# EAGLE design mainbd (EAGLE 9.6.2)
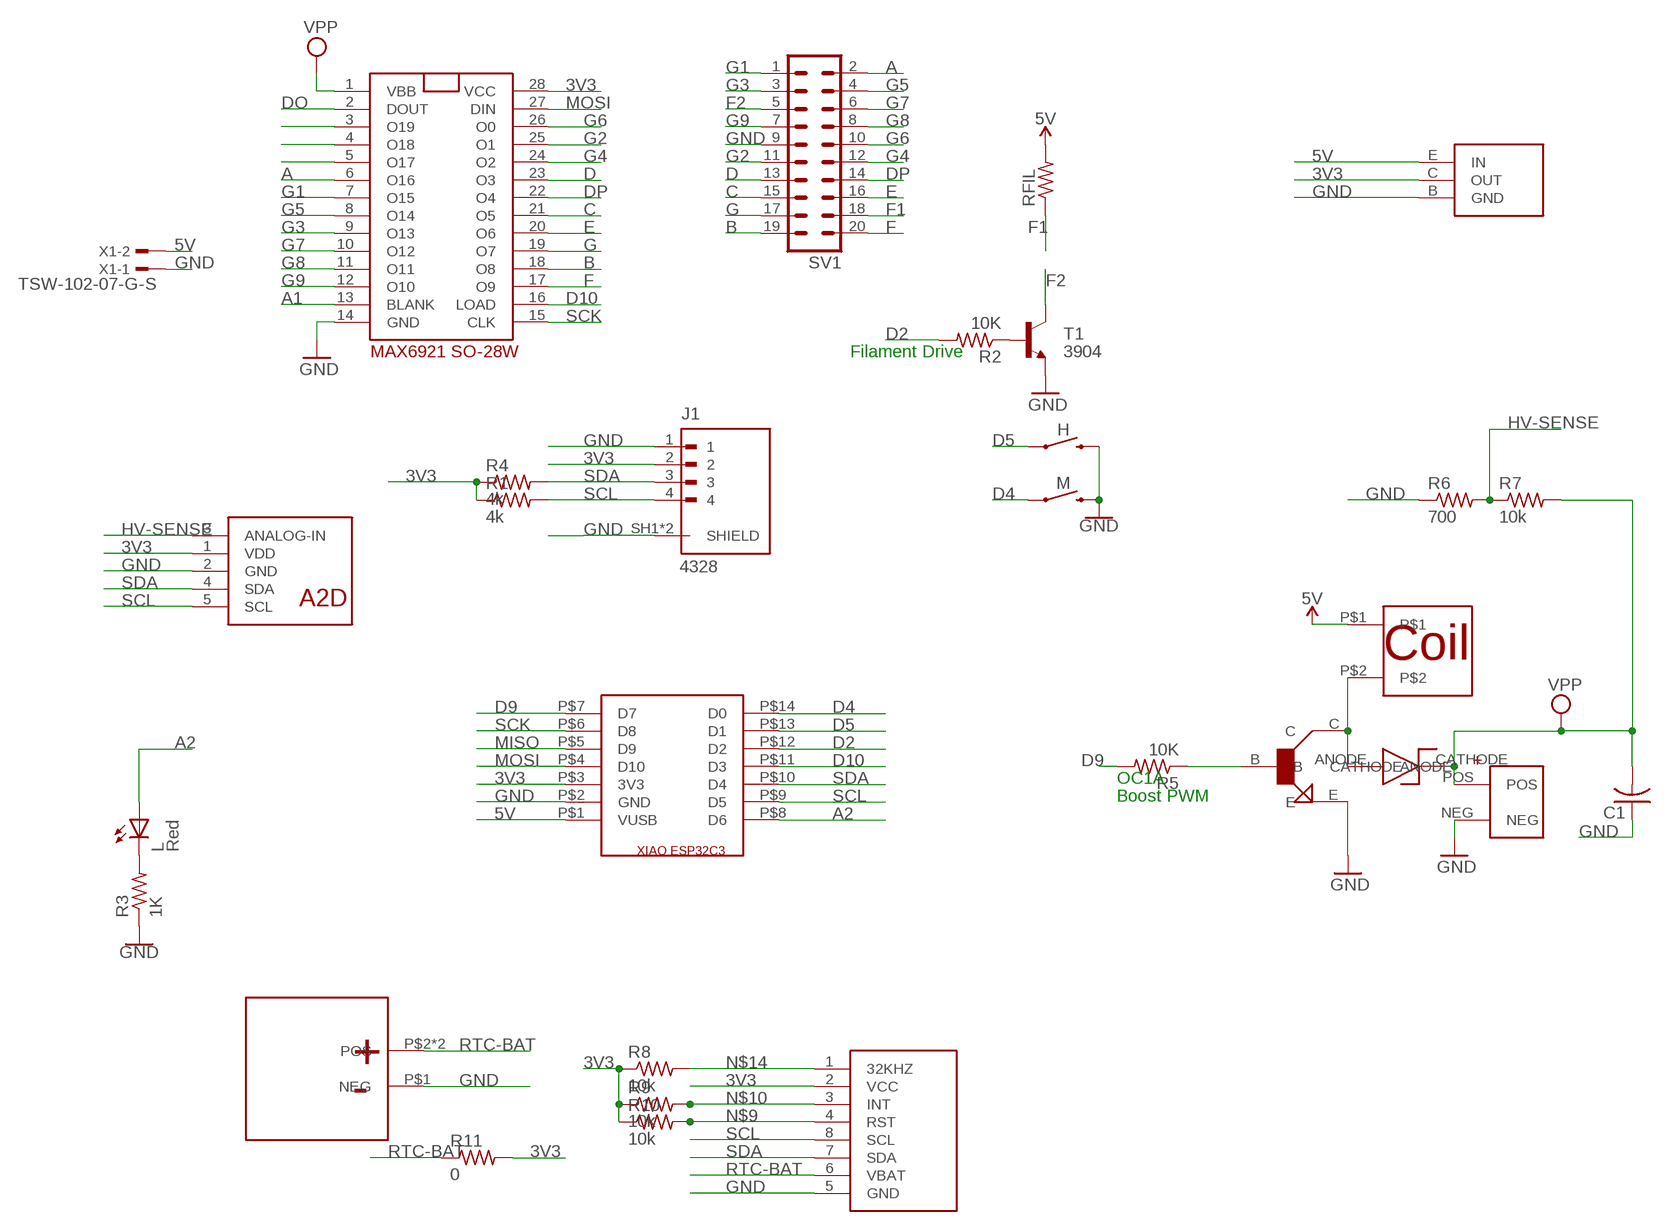
[diagram p0: schematic, sheet 1]

## Parts
3.3V-LDO  LDO-3.3V-AZ1117CR-3.3TRG1  [SOT89-BCE]
.  NPN-2SCR513P5  [SOT89-BCE]
C1  C-USC0805  [C0805]
H  MOMENTARY-SWITCH-SPST-PTH-RIGHT-ANGLE-KIT  [TACTILE_SWITCH_PTH_RIGHT_ANGLE_KIT]
J1  4328  [ADAFRUIT_4328]
L  Red  LEDCHIP-LED0805  [CHIP-LED0805]
M  MOMENTARY-SWITCH-SPST-PTH-RIGHT-ANGLE-KIT  [TACTILE_SWITCH_PTH_RIGHT_ANGLE_KIT]
R1  4k  R-US_R0805W  [R0805W]
R2  10K  R-US_M0805  [M0805]
R3  1K  R-US_M0805  [M0805]
R4  4k  R-US_R0805W  [R0805W]
R5  10K  R-US_M0805  [M0805]
R6  700  R-US_R0805W  [R0805W]
R7  10k  R-US_R0805W  [R0805W]
R8  10k  R-US_M0805  [M0805]
R9  10k  R-US_M0805  [M0805]
R10  10k  R-US_M0805  [M0805]
R11  0  R-US_M0805  [M0805]
RFIL  FLIPFLOP-RES  [0805-THM]
SV1  MA10-2  [MA10-2]
T1  3904  MMBT3904LT1-NPN-SOT23-BEC  [SOT23-BEC]
U$1  MAX6921  [SO28W]
U$3  DS3231M  [SOIC8]
U$4  CAP-330  [CAP-330]
U$5  BATTERY-2998-COIN  [BATTERY-2998-COIN]
U$6  INDUCTOR-453226  [INDUCTOR-453226]
U$7  XIAOESP32C3  [XIAOESP32C3]
U$8  A2D-MCP3221A6T  [SOT23-5]
U$9  DIODE-ZENIER-CMSH1-20MLTR13  [SMA-DIODE]
X1  TSW-102-07-G-S  [TSW-102-XX-G-S]

## Nets
3V3: 3.3V-LDO.C(OUT) J1.2 R1.1 R4.1 R8.1 R9.1 R10.1 R11.2 U$1.28(VCC) U$3.2(VCC) U$7.P$3(3V3) U$8.1(VDD)
5V: 3.3V-LDO.E(IN) RFIL.2 U$6.P$1 U$7.P$1(VUSB) X1.2
A: SV1.2 U$1.6(O16)
A1: U$1.13(BLANK)
A2: L.A U$7.P$8(D6)
B: SV1.19 U$1.18(O8)
C: SV1.15 U$1.21(O5)
D: SV1.13 U$1.23(O3)
D2: R2.2 U$7.P$12(D2)
D4: M.1 U$7.P$14(D0)
D5: H.1 U$7.P$13(D1)
D9: R5.2 U$7.P$7(D7)
D10: U$1.16(LOAD) U$7.P$11(D3)
DO: U$1.2(DOUT)
DP: SV1.14 U$1.22(O4)
E: SV1.16 U$1.20(O6)
F: SV1.20 U$1.17(O9)
F1: RFIL.1 SV1.18
F2: SV1.5 T1.C
G: SV1.17 U$1.19(O7)
G1: SV1.1 U$1.7(O15)
G2: SV1.11 U$1.25(O1)
G3: SV1.3 U$1.9(O13)
G4: SV1.12 U$1.24(O2)
G5: SV1.4 U$1.8(O14)
G6: SV1.10 U$1.26(O0)
G7: SV1.6 U$1.10(O12)
G8: SV1.8 U$1.11(O11)
G9: SV1.7 U$1.12(O10)
GND: 3.3V-LDO.B(GND) ..E C1.1 H.2 J1.1 J1.SH1(SHIELD) J1.SH2(SHIELD) M.2 R3.1 R6.1 SV1.9 T1.E U$1.14(GND) U$3.5(GND) U$4.NEG U$5.P$1(NEG) U$7.P$2(GND) U$8.2(GND) X1.1
HV-SENSE: R6.2 R7.1 U$8.3(ANALOG-IN)
MISO: U$7.P$5(D9)
MOSI: U$1.27(DIN) U$7.P$4(D10)
N$1: L.C R3.2
N$2: ..B R5.1
N$5: ..C U$6.P$2 U$9.ANODE
N$9: R10.2 U$3.4(RST)
N$10: R9.2 U$3.3(INT)
N$11: U$1.3(O19)
N$12: U$1.4(O18)
N$13: U$1.5(O17)
N$14: R8.2 U$3.1(32KHZ)
N$35: R2.1 T1.B
RTC-BAT: R11.1 U$3.6(VBAT) U$5.P$2(POS) U$5.P$3(POS)
SCK: U$1.15(CLK) U$7.P$6(D8)
SCL: J1.4 R1.2 U$3.8(SCL) U$7.P$9(D5) U$8.5(SCL)
SDA: J1.3 R4.2 U$3.7(SDA) U$7.P$10(D4) U$8.4(SDA)
VPP: C1.2 R7.2 U$1.1(VBB) U$4.POS U$9.CATHODE

## Notes on the sheet
- Filament Drive
- OC1A
- Boost PWM

## Library data of the parts
3.3V-LDO = mgregg:LDO-3.3V-AZ1117CR-3.3TRG1
. = mgregg:NPN-2SCR513P5
C1 = rcl:C-US: CAPACITOR, American symbol; SPICEPREFIX: C
H M = SparkFun-Switches:MOMENTARY-SWITCH-SPST: Momentary Switch (Pushbutton) - SPST Normally-open (NO) SPST momentary switches (buttons, pushbuttons). Variants PTH-12MM - 12mm square, through-hole Momentary Pushbutton Switch - 12mm Square <https://www.sparkfun.com/products/9190> (COM-09190) PTH-6.0MM, PTH-6.0MM-KIT - 6.0mm square, through-hole Mini Pushbutton Switch <https://www.sparkfun.com/products/97> (COM-00097) KIT package intended for soldering kit's - only one side of pads' copper is exposed. PTH-RIGHT-ANGLE-KIT - Right-angle, through-hole Right Angle Tactile Button <https://www.sparkfun.com/products/10791> - Used on SparkFun BigTime Watch Kit <https://www.sparkfun.com/products/11734> SMD-12MM - 12mm square, surface-mount Tactile Button - SMD (12mm) <https://www.sparkfun.com/products/12993> (COM-12993) Used on SparkFun PicoBoard <https://www.sparkfun.com/products/11888> SMD-4.5MM - 4.5mm Square Trackball Switch Used on SparkFun Blackberry Trackballer Breakout <https://www.sparkfun.com/products/13169> SMD-4.6MMX2.8MM - 4.60mm x 2.80mm, surface mount Used on SparkFun SAMD21 Mini Breakout <https://www.sparkfun.com/products/13664> SMD-5.2MM, SMD-5.2-REDUNDANT - 5.2mm square, surface-mount Mini Pushbutton Switch - SMD <https://www.sparkfun.com/products/8720> (COM-08720) Used on Arduino Pro Mini <https://www.sparkfun.com/products/11114> REDUNDANT package connects both switch circuits together SMD-6.0X3.5MM - 6.0 x 3.5mm, surface mount Momentary Reset Switch SMD <https://www.sparkfun.com/products/8229> (COM-08229) SMD-6.2MM-TALL - 6.2mm square, surface mount Tactile Button - SMD (6mm) <https://www.sparkfun.com/products/12992> Used on SparkFun Digital Sandbox <https://www.sparkfun.com/products/12651> SMD-RIGHT-ANGLE - Right-angle, surface mount Used on SparkFun Block for Intel® Edison - Arduino <https://www.sparkfun.com/products/13036>; PROD_ID: CONN-10672; SF_SKU: COM-10791
J1 = adafruit-jst-sh-4328:4328: Check availability <https://pricing.snapeda.com/parts/4328/Adafruit/view-part?ref=eda>; AVAILABILITY: Not in stock; CHECK_PRICES: https://www.snapeda.com/parts/4328/Adafruit+Industries/view-part/?ref=eda; DESCRIPTION: Adafruit Accessories JST SH 4-pin Vertical Connector (10-pack) - Qwiic Compatible; MF: Adafruit; MP: 4328; PACKAGE: None; PRICE: None; PURCHASE-URL: https://www.snapeda.com/api/url_track_click_mouser/?unipart_id=12414535&manufacturer=Adafruit&part_name=4328&search_term=None; SNAPEDA_LINK: https://www.snapeda.com/parts/4328/Adafruit+Industries/view-part/?ref=snap
L = adafruit:LED: LED OSRAM: - CHIPLED LG R971, LG N971, LY N971, LG Q971, LY Q971, LO R971, LY R971 LH N974, LH R974 LS Q976, LO Q976, LY Q976 LO Q996 - Hyper CHIPLED LW Q18S LB Q993, LB Q99A, LB R99A - SideLED LS A670, LO A670, LY A670, LG A670, LP A670 LB A673, LV A673, LT A673, LW A673 LH A674 LY A675 LS A676, LA A676, LO A676, LY A676, LW A676 LS A679, LY A679, LG A679 - Hyper Micro SIDELED® LS Y876, LA Y876, LO Y876, LY Y876 LT Y87S - SmartLED LW L88C, LW L88S LB L89C, LB L89S, LG L890 LS L89K, LO L89K, LY L89K LS L896, LA L896, LO L896, LY L896 - TOPLED LS T670, LO T670, LY T670, LG T670, LP T670 LSG T670, LSP T670, LSY T670, LOP T670, LYG T670 LG T671, LOG T671, LSG T671 LB T673, LV T673, LT T673, LW T673 LH T674 LS T676, LA T676, LO T676, LY T676, LB T676, LH T676, LSB T676, LW T676 LB T67C, LV T67C, LT T67C, LS T67K, LO T67K, LY T67K, LW E67C LS E67B, LA E67B, LO E67B, LY E67B, LB E67C, LV E67C, LT E67C LW T67C LS T679, LY T679, LG T679 LS T770, LO T770, LY T770, LG T770, LP T770 LB T773, LV T773, LT T773, LW T773 LH T774 LS E675, LA E675, LY E675, LS T675 LS T776, LA T776, LO T776, LY T776, LB T776 LHGB T686 LT T68C, LB T68C - Hyper Mini TOPLED® LB M676 - Mini TOPLED Santana® LG M470 LS M47K, LO M47K, LY M47K Source: http://www.osram.convergy.de/
R1 R4 R6-R11 = rcl:R-US_: RESISTOR, American symbol; SPICEPREFIX: R
R2 R3 R5 = adafruit:R-US_: RESISTOR, American symbol
RFIL = adafruit:FLIPFLOP-RES: Flip Flop resistor An 0805 resistor inside a standard 1/4W 5% resistor. Makes for easy mods
SV1 = con-lstb:MA10-2: PIN HEADER; OC_FARNELL: unknown; OC_NEWARK: unknown
T1 = DC_LOAD_AU:*-NPN-: NPN Transistror BF959 corrected 2008.03.06
U$1 = sjm4306-custom:MAX6921: Maxim Integrated 20-Output, 76V, Serial-Interfaced VFD Tube Drivers
U$3 = mgregg:DS3231M
U$4 = mgregg:CAP-330
U$5 = mgregg:BATTERY-2998-COIN
U$6 = mgregg:INDUCTOR-453226
U$7 = mgregg:XIAOESP32C3
U$8 = mgregg:A2D-MCP3221A6T
U$9 = mgregg:DIODE-ZENIER-CMSH1-20MLTR13
X1 = con-samtec:TSW-102-*-G-S: THROUGH-HOLE .025" SQ POST HEADER Source: Samtec TSW.pdf; MF: Samtec Inc.; MPN: TSW-102-07-G-S

## Board
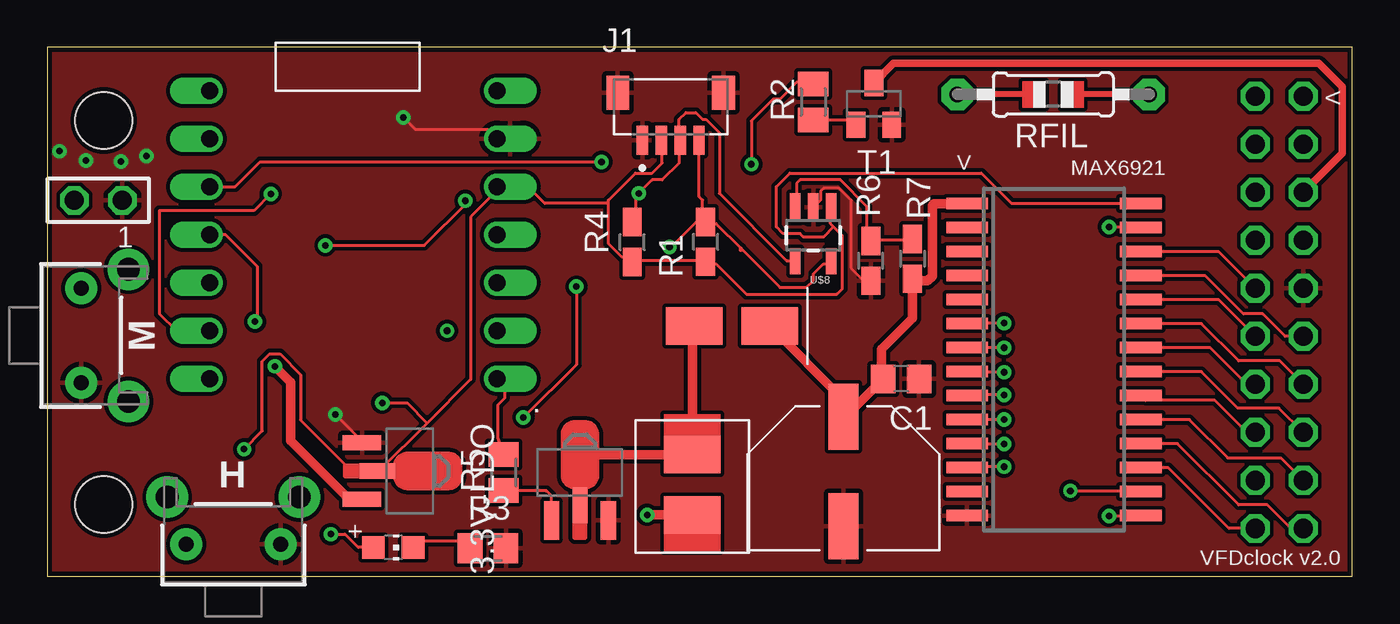
[diagram p1: board, top side]
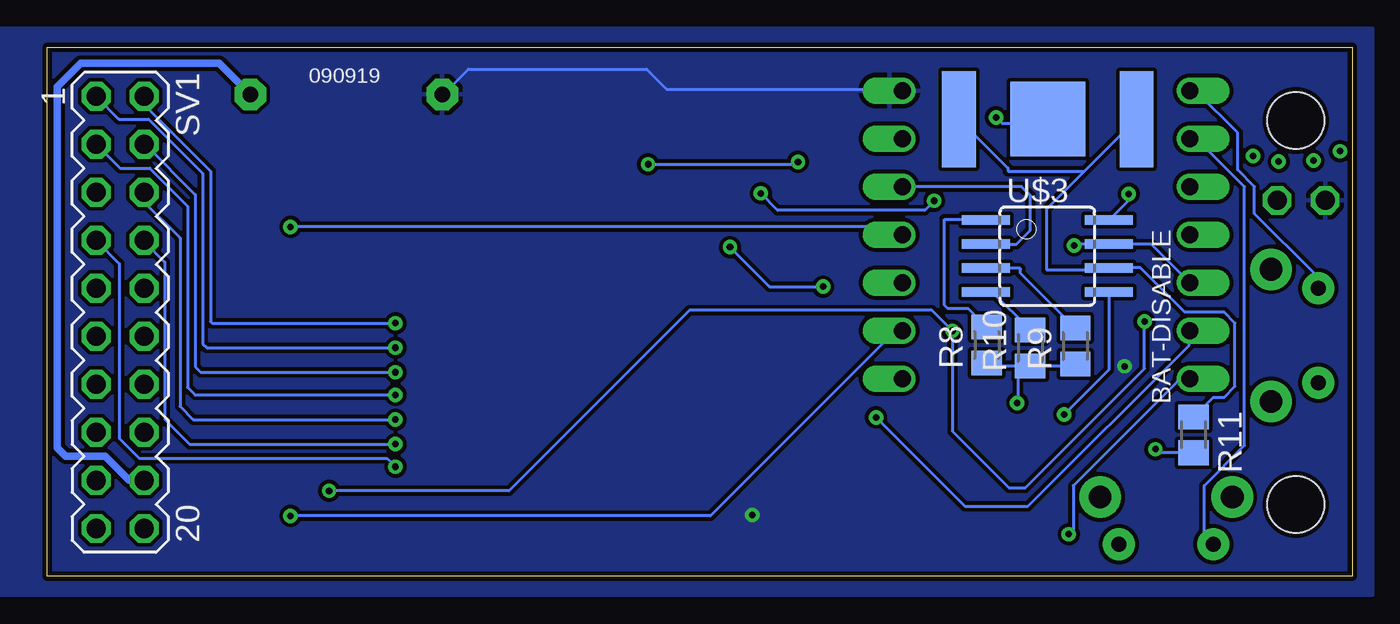
[diagram p2: board, bottom side, seen from below]

Size 69.08 x 28 mm. Coordinates in mm from the lower left corner, seen from the top.
Outline: 0,0 69.08,0 69.08,28 0,28 0,0
Copper layers (1*16): Top 0.035mm / dielectric 1.5mm / Bottom 0.035mm
Design rules "default *": minimum track width 6mil, minimum drill 0.35mm, track to track 8mil, track to pad 8mil, pad to pad 8mil, via to via 8mil, smd to smd 8mil, copper to edge 10mil, drill to drill 8mil, minimum pad ring 10mil, minimum via ring 8mil, stop-mask expansion 4mil, vias tented up to drill 15mil, thermal gap 10mil
Holes 3 mm at 2.99,24.13 2.99,3.81

### Footprints (pad centres in the part's own frame; a part is rotated, then mirrored left to right if it is on the bottom)
SOT89-BCE = smd 0.8 x 2.032: B -1.499,-2.54; E 1.499,-2.54 | smd 0.8 x 1.9: C 0,-1.727
C0805 = smd 1.3 x 1.5: 1 -0.95,0; 2 0.95,0
TACTILE_SWITCH_PTH_RIGHT_ANGLE_KIT = drill 0.8 pad 1.7: 1 -2.5,0; 2 2.5,0 | drill 1.2 pad 2.2: ANCHOR1 -3.5,2.5; ANCHOR2 3.5,2.5
ADAFRUIT_4328 = smd 0.6 x 1.55: 1 -1.5,-1.775; 2 -0.5,-1.775; 3 0.5,-1.775; 4 1.5,-1.775 | smd 1.2 x 1.8: SH1 -2.8,0.75; SH2 2.8,0.75
CHIP-LED0805 = smd 1.2 x 1.2: A 0,-1.05; C 0,1.05
R0805W = smd 1.5 x 1: 1 -1.052,0; 2 1.052,0
M0805 = smd 1.3 x 1.6: 1 -0.95,0; 2 0.95,0
0805-THM = drill 0.813 pad 1.676 octagon: 1 -5.08,0; 2 5.08,0
MA10-2 = drill 1.016 octagon: 1 -11.43,-1.27; 2 -11.43,1.27; 3 -8.89,-1.27; 4 -8.89,1.27; 5 -6.35,-1.27; 6 -6.35,1.27; 7 -3.81,-1.27; 8 -3.81,1.27; 9 -1.27,-1.27; 10 -1.27,1.27; 11 1.27,-1.27; 12 1.27,1.27; 13 3.81,-1.27; 14 3.81,1.27; 15 6.35,-1.27; 16 6.35,1.27; 17 8.89,-1.27; 18 8.89,1.27; 19 11.43,-1.27; 20 11.43,1.27
SOT23-BEC = smd 1 x 1.4: B -0.95,-1.1; C 0,1.1; E 0.95,-1.1
SO28W = smd 0.6 x 2.2: 1 -8.255,-4.6; 2 -6.985,-4.6; 3 -5.715,-4.6; 4 -4.445,-4.6; 5 -3.175,-4.6; 6 -1.905,-4.6; 7 -0.635,-4.6; 8 0.635,-4.6; 9 1.905,-4.6; 10 3.175,-4.6; 11 4.445,-4.6; 12 5.715,-4.6; 13 6.985,-4.6; 14 8.255,-4.6; 15 8.255,4.6; 16 6.985,4.6; 17 5.715,4.6; 18 4.445,4.6; 19 3.175,4.6; 20 1.905,4.6; 21 0.635,4.6; 22 -0.635,4.6; 23 -1.905,4.6; 24 -3.175,4.6; 25 -4.445,4.6; 26 -5.715,4.6; 27 -6.985,4.6; 28 -8.255,4.6
SOIC8 = smd 0.5 x 2.54: 1 -1.905,-3.251; 2 -0.645,-3.251; 3 0.625,-3.251; 4 1.895,-3.251; 5 1.905,3.251; 6 0.635,3.251; 7 -0.635,3.251; 8 -1.905,3.251
CAP-330 = smd 3.5 x 1.6: NEG 0,0; POS 5.8,0
BATTERY-2998-COIN = smd 3.96 x 3.96: P$1 0,0 | smd 1.78 x 5.08: P$2 -4.7,0; P$3 4.7,0
INDUCTOR-453226 = smd 3 x 2: P$1 0,0; P$2 0,3.2
XIAOESP32C3 = drill 0.9 offset: P$1 0,0; P$2 0,2.54; P$3 0,5.08; P$4 0,7.62; P$5 0,10.16; P$6 0,12.7; P$7 0,15.24; P$8 15.2,15.24; P$9 15.2,12.7; P$10 15.2,10.16; P$11 15.2,7.62; P$12 15.2,5.08; P$13 15.2,2.54; P$14 15.2,0
SOT23-5 = smd 0.55 x 1.524: 1 -0.95,-1.473; 2 0,-1.473; 3 0.95,-1.473 | smd 0.55 x 1.397: 4 0.95,1.372; 5 -0.95,1.372
SMA-DIODE = smd 2 x 3: ANODE 0,0; CATHODE 0,4
TSW-102-XX-G-S = drill 1 pad 1.5 octagon: 1 1.27,0; 2 -1.27,0

### Placement (x,y rotation side)
3.3V-LDO  19.2,5.58 270 top
.  28.2,5.5 0 top
C1  45.2,10.45 180 top
H  9.85,1.7 0 top
J1  33,24.85 0 top
L  18.31,1.54 270 top
M  1.8,12.75 270 top
R1  34.85,17.7 90 top
R2  40.55,25.1 90 top
R3  23.33,1.49 180 top
R4  30.97,17.69 90 top
R5  24.16,5.49 90 top
R6  43.6,16.7 90 top
R7  45.8,16.8 270 top
R8  19.35,12.25 90 bottom
R9  14.66,12.19 90 bottom
R10  17.05,12.09 90 bottom
R11  8.4,7.49 270 bottom
RFIL  53.25,25.5 180 top
SV1  65.22,13.97 270 bottom
T1  43.75,25 0 top
U$1  53.29,11.47 270 top
U$2  [SJM4306_SMALL_NO_MASK]  16.2,17.6 45 top
U$3  16.14,16.94 270 bottom
U$4  42.15,2.65 90 top
U$5  16.12,24.2 0 bottom
U$6  34.15,3.25 0 top
U$7  23.8,25.7 180 top
U$8  40.55,18.05 180 top
U$9  34.25,13.25 270 top
X1  2.7,19.9 0 top

### Tracks (layer width: path | path; a pad name or v marks a point on that pad's centre or on a via)
3V3  (via drill 0.35)
  Top 0.152: 41.62,18.49 42.08,18.03 42.08,15.21 41.8,14.94 37,14.94 35.4,16.54 34.87,16.54 R1.1 34.69,16.71 31.08,16.71 R4.1 30.85,16.89 30.42,16.89 29.71,17.6 29.71,19.74 | 41.62,18.49 41.45,18.67 41.45,19.38 U$8.1 | 29.71,19.74 29.71,19.91 31.13,21.34 32.02,21.34 32.56,21.87 32.56,22.94 J1.2 | 41.62,18.49 41.09,17.96 40.02,17.96 39.84,18.14 38.96,18.14 38.6,18.49 38.6,20.62 39.31,21.34 49.45,21.34 51.05,19.74 57.8,19.74 U$1.28 | 23.84,20.45 25.62,20.45 26.33,19.74 29.71,19.74 | 20.11,8.12 22.42,10.43 22.42,19.02 23.84,20.45 | 20.11,8.12 17.57,5.58 3.3V-LDO.C 17.46,5.57 16.11,5.57 13.41,8.27 13.41,10.68 12.32,11.77 11.77,11.77 11.39,11.39 11.39,7.7 v10.42,6.73 | 23.84,20.45 U$7.P$3 | v17.74,9.18 19.05,9.18 20.11,8.12
  Bottom 0.152: R8.1 19.2,11.14 R10.1 | R10.1 14.75,11.14 R9.1 | U$3.2 17.77,17.59 17.05,18.31 17.05,20.17 17.5,20.62 U$7.P$3 | R10.1 17.69,10.5 17.69,9.22 v17.74,9.18 | R11.2 10.27,6.54 10.44,6.71 | 10.44,6.71 | 10.44,6.71 v10.42,6.73
5V  (via drill 0.35)
  Top 0.152: 32.91,3.2 33.98,3.2 U$6.P$1 | 16.67,4.04 3.3V-LDO.E 16.49,4.04
  Top 0.508: 3.3V-LDO.E 15.97,4.08 12.88,7.17 12.88,10.28 v12.04,11.12 | U$6.P$1 v31.76,3.25
  Bottom 0.152: U$7.P$1 23.84,25.78 36.29,25.78 37.36,26.85 46.78,26.85 48.02,25.6 RFIL.2
  pour Bottom (rank 2): -1.11,-1 -1.11,29 71.75,29 71.75,-1
A  (via drill 0.35)
  Top 0.152: v50.65,13.4 48.72,13.4 U$1.6
  Bottom 0.152: SV1.2 63.95,24.95 60.44,21.43 60.44,13.49 60.35,13.4 v50.65,13.4
A2  (via drill 0.35)
  Top 0.152: v15.01,2.23 15.76,2.23 16.46,1.54 L.A
  Bottom 0.152: v15.01,2.23 14.78,2.47 14.78,4.8 9.26,10.31 8.73,10.31 U$7.P$8
B
  Top 0.152: SV1.19 65.83,2.54 64.59,3.78 63.07,3.78 59.82,7.03 U$1.18
C
  Top 0.152: SV1.15 65.2,8.91 63.02,8.91 61.09,10.84 U$1.21
D
  Top 0.152: SV1.13 65.25,11.4 63.07,11.4 61.09,13.38 U$1.23
D2  (via drill 0.35)
  Top 0.152: R2.2 40.38,26.14 39.67,26.14 38.78,25.25 38.42,25.25 37.27,24.1 v37.27,21.81 | U$7.P$12 9.96,20.62 11.27,21.93 v29.34,21.93
  Bottom 0.152: 8.73,20.62 U$7.P$12 | v37.27,21.81 29.61,21.81 29.53,21.73 29.34,21.92 v29.34,21.93
D4
  Bottom 0.152: U$7.P$14 8.55,25.6 8.2,25.6 6.06,23.47 6.06,21.51 5.17,20.62 5.17,19.2 1.97,16 1.97,15.29 M.1
D5
  Bottom 0.152: U$7.P$13 8.55,23.11 8.2,23.11 5.71,20.63 5.71,6.93 7.84,4.8 7.84,2.13 7.49,1.78 H.1
D9
  Top 0.152: R5.2 23.84,7.33 23.84,9.07 24.2,9.42 24.2,9.96 23.84,10.31 U$7.P$7
D10  (via drill 0.35)
  Top 0.152: v54.16,4.53 57.85,4.53 U$1.16 | v11,13.48 11.12,13.61 11.12,16.4 9.44,18.08 U$7.P$11
  Bottom 0.152: v54.16,4.53 44.64,4.53 35.08,14.09 22.26,14.09 v21.17,13 21.17,7.69 18.18,4.7 17.29,4.7 11,10.99 v11,13.48
DP
  Top 0.152: SV1.14 63.5,10.16 61.56,12.11 U$1.22
E
  Top 0.152: SV1.16 63.5,7.62 61.81,9.31 58.14,9.31 U$1.20
F
  Top 0.152: SV1.20 62.55,2.54 59.33,5.75 U$1.17
F1
  Bottom 0.406: SV1.18 64.73,5.08 66,6.35 68.1,6.35 68.55,6.8 68.55,25.9 67.3,27.15 59.98,27.15 RFIL.1
F2
  Top 0.406: SV1.5 68.55,22.38 68.55,25.9 67.3,27.15 44.8,27.15 T1.C
G
  Top 0.152: U$1.19 60.45,8.29 62.48,6.27 65.3,6.27 SV1.17
G1  (via drill 0.35)
  Top 0.152: v50.65,12.1 U$1.7
  Bottom 0.152: SV1.1 65.29,24.2 63.71,24.2 60.84,21.33 60.84,12.29 60.65,12.1 v50.65,12.1
G2
  Top 0.152: SV1.11 65.53,12.7 64.34,13.89 63.32,13.89 61.29,15.91 U$1.25
G3  (via drill 0.35)
  Top 0.152: v50.65,9.6 48.73,9.6 U$1.9
  Bottom 0.152: SV1.3 65.23,21.6 63.65,21.6 61.65,19.6 61.65,10 61.25,9.6 v50.65,9.6
G4
  Top 0.152: SV1.12 62,14.64 U$1.24
G5  (via drill 0.35)
  Top 0.152: v50.65,10.8 48.73,10.8 U$1.8
  Bottom 0.152: SV1.4 63.9,22.86 61.24,20.2 61.24,11.09 60.95,10.8 v50.65,10.8
G6
  Top 0.152: SV1.10 62,17.18 U$1.26
G7  (via drill 0.35)
  Top 0.152: v50.65,8.3 U$1.10
  Bottom 0.152: SV1.6 63.95,19.81 62.05,17.91 62.05,9 61.35,8.3 v50.65,8.3
G8  (via drill 0.35)
  Top 0.152: v50.65,7 48.72,7 U$1.11
  Bottom 0.152: SV1.8 63.95,17.73 62.86,16.63 62.86,8.31 61.55,7 v50.65,7
G9  (via drill 0.35)
  Top 0.152: v50.65,5.8 48.73,5.8 U$1.12
  Bottom 0.152: SV1.7 65.26,16.55 65.26,7.31 64.2,6.25 51.1,6.25 v50.65,5.8
GND  (via drill 0.35)
  Top 0.152: U$8.2 40.95,19.92 40.95,20.4 41.11,20.57 41.89,20.57 42.55,19.91 42.55,16.31 43.21,15.65 R6.1 | v15.25,8.57 16.66,7.16 3.3V-LDO.B | v18.86,24.29 19.51,23.64 23.33,23.64 U$7.P$2
  Bottom 0.152: U$3.5 12.89,10.93 v15.25,8.57 | v15.25,8.57 | U$5.P$1 17.82,24.2 18.04,23.99 18.56,23.99 v18.86,24.29
  other vias: 5.25,22.25 3.9,21.95 0.65,22.5 2.05,22
  pour Top: -23.25,-1.1 -23.25,28.9 70.75,29 70.75,-1
HV-SENSE
  Top 0.152: R7.1 45.71,17.78 43.76,17.78 R6.2 43.58,17.78 43.4,17.96 43.4,19.56 41.98,20.98 39.84,20.98 39.67,20.8 39.67,19.56 U$8.3
MOSI  (via drill 0.35)
  Top 0.152: v56.2,18.49 57.8,18.49 U$1.27
  Bottom 0.152: v56.2,18.49 24.2,18.49 23.84,18.14 U$7.P$4
N$1
  Top 0.152: L.C 19.84,1.87 21.8,1.87 R3.2
N$2
  Top 0.152: R5.1 26.35,4.54 26.38,4.52 26.43,4.52 26.69,4.27 26.69,3.02 ..B
N$5
  Top 0.152: 34.16,6.58 U$6.P$2 33.98,6.4 33.62,6.04 | 34.16,13.16 U$9.ANODE | 28.29,4.98 28.29,3.91 ..C
  Top 0.2: 28.29,4.98 28.29,6.35 28.39,6.45
  Top 0.508: 28.1,6.74 28.39,6.45 U$6.P$2 34.15,13.15 U$9.ANODE
N$9
  Bottom 0.152: R10.2 19.05,15.05 U$3.4
N$10
  Bottom 0.152: R9.2 17.56,16.04 17.56,16.28 17.6,16.32 U$3.3
N$14
  Bottom 0.152: R8.2 20.32,14.17 21.41,14.17 21.58,14.34 21.58,18.89 19.43,18.89 U$3.1
N$35
  Top 0.152: T1.B 42.55,24.15 R2.1
RTC-BAT
  Bottom 0.152: U$5.P$3 14.18,21.44 | 14.18,21.44 16.19,19.43 16.19,16.24 12.96,16.24 12.91,16.29 U$3.6 12.86,16.33 11.22,16.33 8.87,13.98 6.79,13.98 6.21,13.41 6.21,10.05 6.79,9.48 7.36,9.48 R11.1 | U$5.P$2 18.22,21.6 18.22,21.44 14.18,21.44
SCK  (via drill 0.35)
  Top 0.152: v56.2,3.2 57.8,3.2 U$1.15
  Bottom 0.152: v56.2,3.2 33.98,3.2 24.2,12.98 23.84,12.98 U$7.P$6
SCL  (via drill 0.35)
  Top 0.152: U$8.5 41.45,16.54 41.09,16.54 40.56,16 40.56,15.65 40.2,15.29 38.78,15.29 36.71,17.36 35.4,18.67 34.87,18.67 R1.2 | J1.4 34.51,22.94 34.51,20.09 34.69,19.91 34.69,18.85 R1.2 | v11.83,20.24 10.95,19.36 5.93,19.36 5.93,13.91 6.84,13 U$7.P$9 | R1.2 34.35,18.75 32.98,17.38 v32.94,17.43 | v28.01,15.33 28.01,11.21 v25.21,8.41
  Top 0.2: 36.71,17.27 36.71,17.36
  Bottom 0.152: 8.73,13.16 U$7.P$9 8.63,13.03 8.63,12.24 17.17,3.7 20.5,3.7 v25.21,8.41 | U$3.8 11.83,19.91 v11.83,20.24 | v32.94,17.43 30.84,15.33 v28.01,15.33
SDA  (via drill 0.35)
  Top 0.152: U$8.4 39.49,16.71 39.13,16.71 35.58,20.27 35.58,23.47 34.87,24.18 34.69,24.18 34.33,24.54 33.8,24.54 33.45,24.18 33.45,23.11 J1.3 33.45,22.94 33.45,21.87 32.56,20.98 32.02,20.98 v31.31,20.27 31.13,20.09 31.13,18.9 R4.2 | v14.72,17.51 19.95,17.51 22.22,19.79 | 22.22,19.79 | 22.22,19.79 v22.13,19.88
  Bottom 0.152: v31.31,20.27 30.41,19.37 22.62,19.37 22.13,19.86 v22.13,19.88 | 8.73,15.65 U$7.P$10 10.64,17.58 U$3.7 14.76,17.58 14.77,17.57 | 14.77,17.57 | 14.77,17.57 v14.72,17.51
VPP
  Top 0.152: 43.76,10.31 44.11,10.31 44.17,10.37 C1.2 44.11,10.49 44.11,11.2 | 42.16,8.71 42.16,8.68 42.16,8.53 U$4.POS 42.16,8.71 | 42.16,8.71 42.16,9.07 | 48.56,19.74 U$1.1 | 38.42,12.45 38.42,13.16 U$9.CATHODE | 45.89,15.47 45.89,15.65 R7.2 45.89,15.47
  Top 0.508: U$9.CATHODE 42.16,9.34 42.16,8.71 | C1.2 42.48,8.68 42.16,8.68 | R7.2 45.8,13.65 44.17,12.02 44.17,10.37 | U$1.1 46.94,19.73 46.85,19.63 46.85,15.89 46.6,15.65 45.89,15.65
(copper drawn outside any net)
  shapes: Top area x2

### Text on the board
tPlace: V | V | VFDclock v2.0
bPlace: 090919 | BAT-DISABLE